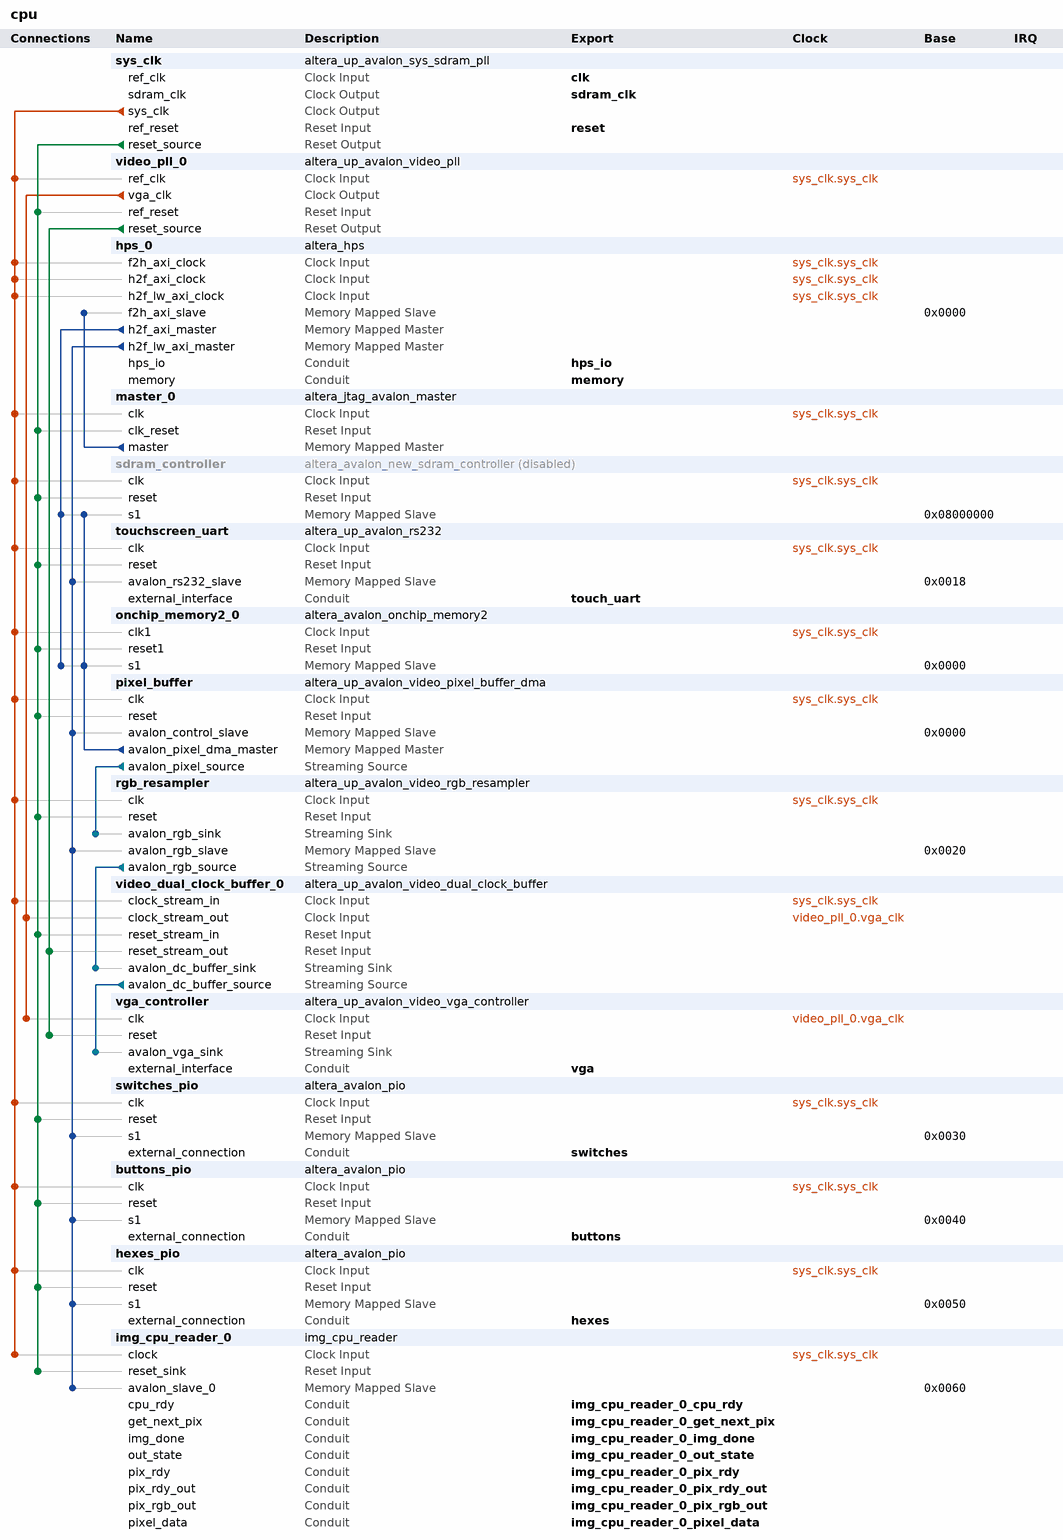
[diagram p0: system contents]
# Platform Designer (Qsys) system cpu, Cyclone V 5CSEMA5F31C6
# Parameters at their usual value, and those the tool derives, are not listed.
package require -exact qsys 18.1
create_system cpu
set_project_property DEVICE_FAMILY {Cyclone V}
set_project_property DEVICE 5CSEMA5F31C6

add_instance sys_clk altera_up_avalon_sys_sdram_pll 18.0
set_instance_parameter_value sys_clk CV_boards DE1-SoC
set_instance_parameter_value sys_clk gui_outclk 50.0
set_instance_parameter_value sys_clk gui_refclk 50.0

add_instance video_pll_0 altera_up_avalon_video_pll 18.0
set_instance_parameter_value video_pll_0 camera {5MP Digital Camera (THDB_D5M)}
set_instance_parameter_value video_pll_0 gui_refclk 50.0
set_instance_parameter_value video_pll_0 lcd {7" LCD on VEEK-MT and MTL/MTL2 Modules}

add_instance hps_0 altera_hps 18.1
set_instance_parameter_value hps_0 EMAC1_Mode RGMII
set_instance_parameter_value hps_0 EMAC1_PinMuxing {HPS I/O Set 0}
set_instance_parameter_value hps_0 F2SCLK_COLDRST_Enable false
set_instance_parameter_value hps_0 F2SCLK_DBGRST_Enable false
set_instance_parameter_value hps_0 F2SCLK_WARMRST_Enable false
set_instance_parameter_value hps_0 F2SINTERRUPT_Enable false
set_instance_parameter_value hps_0 F2S_Width 2
set_instance_parameter_value hps_0 FPGA_PERIPHERAL_OUTPUT_CLOCK_FREQ_EMAC0_GTX_CLK 125
set_instance_parameter_value hps_0 FPGA_PERIPHERAL_OUTPUT_CLOCK_FREQ_EMAC0_MD_CLK 2.5
set_instance_parameter_value hps_0 FPGA_PERIPHERAL_OUTPUT_CLOCK_FREQ_EMAC1_GTX_CLK 125
set_instance_parameter_value hps_0 FPGA_PERIPHERAL_OUTPUT_CLOCK_FREQ_EMAC1_MD_CLK 2.5
set_instance_parameter_value hps_0 HPS_PROTOCOL DDR3
set_instance_parameter_value hps_0 I2C0_Mode I2C
set_instance_parameter_value hps_0 I2C0_PinMuxing {HPS I/O Set 0}
set_instance_parameter_value hps_0 I2C1_Mode I2C
set_instance_parameter_value hps_0 I2C1_PinMuxing {HPS I/O Set 0}
set_instance_parameter_value hps_0 LWH2F_Enable true
set_instance_parameter_value hps_0 MEM_BANKADDR_WIDTH 3
set_instance_parameter_value hps_0 MEM_CLK_FREQ 400.0
set_instance_parameter_value hps_0 MEM_COL_ADDR_WIDTH 10
set_instance_parameter_value hps_0 MEM_DQ_WIDTH 32
set_instance_parameter_value hps_0 MEM_DRV_STR RZQ/7
set_instance_parameter_value hps_0 MEM_ROW_ADDR_WIDTH 15
set_instance_parameter_value hps_0 MEM_RTT_NOM RZQ/4
set_instance_parameter_value hps_0 MEM_RTT_WR RZQ/4
set_instance_parameter_value hps_0 MEM_TCL 11
set_instance_parameter_value hps_0 MEM_TFAW_NS 30.0
set_instance_parameter_value hps_0 MEM_TRAS_NS 35.0
set_instance_parameter_value hps_0 MEM_TRCD_NS 13.75
set_instance_parameter_value hps_0 MEM_TRFC_NS 260.0
set_instance_parameter_value hps_0 MEM_TRP_NS 13.75
set_instance_parameter_value hps_0 MEM_VENDOR JEDEC
set_instance_parameter_value hps_0 MEM_WTCL 8
set_instance_parameter_value hps_0 QSPI_Mode {1 SS}
set_instance_parameter_value hps_0 QSPI_PinMuxing {HPS I/O Set 0}
set_instance_parameter_value hps_0 REF_CLK_FREQ 25.0
set_instance_parameter_value hps_0 S2FCLK_USER2CLK 5
set_instance_parameter_value hps_0 S2F_Width 2
set_instance_parameter_value hps_0 SDIO_Mode {4-bit Data}
set_instance_parameter_value hps_0 SDIO_PinMuxing {HPS I/O Set 0}
set_instance_parameter_value hps_0 SPIM1_Mode {Single Slave Select}
set_instance_parameter_value hps_0 SPIM1_PinMuxing {HPS I/O Set 0}
set_instance_parameter_value hps_0 STM_Enable false
set_instance_parameter_value hps_0 TIMING_BOARD_AC_SKEW 0.02
set_instance_parameter_value hps_0 TIMING_BOARD_AC_TO_CK_SKEW 0.01
set_instance_parameter_value hps_0 TIMING_BOARD_DQ_TO_DQS_SKEW 0.05
set_instance_parameter_value hps_0 TIMING_BOARD_MAX_CK_DELAY 0.03
set_instance_parameter_value hps_0 TIMING_BOARD_MAX_DQS_DELAY 0.02
set_instance_parameter_value hps_0 TIMING_BOARD_SKEW_BETWEEN_DQS 0.06
set_instance_parameter_value hps_0 TIMING_BOARD_SKEW_CKDQS_DIMM_MAX 0.12
set_instance_parameter_value hps_0 TIMING_BOARD_SKEW_CKDQS_DIMM_MIN 0.06
set_instance_parameter_value hps_0 TIMING_BOARD_SKEW_WITHIN_DQS 0.01
set_instance_parameter_value hps_0 TIMING_TDH 65
set_instance_parameter_value hps_0 TIMING_TDQSCK 225
set_instance_parameter_value hps_0 TIMING_TDQSQ 125
set_instance_parameter_value hps_0 TIMING_TDS 30
set_instance_parameter_value hps_0 TIMING_TIH 140
set_instance_parameter_value hps_0 TIMING_TIS 180
set_instance_parameter_value hps_0 TIMING_TQSH 0.4
set_instance_parameter_value hps_0 UART0_Mode {No Flow Control}
set_instance_parameter_value hps_0 UART0_PinMuxing {HPS I/O Set 0}
set_instance_parameter_value hps_0 USB1_Mode SDR
set_instance_parameter_value hps_0 USB1_PinMuxing {HPS I/O Set 0}
set_instance_parameter_value hps_0 desired_cfg_clk_mhz 100.0
set_instance_parameter_value hps_0 desired_qspi_clk_mhz 400.0

add_instance master_0 altera_jtag_avalon_master 18.1

add_instance sdram_controller altera_avalon_new_sdram_controller 18.1
set_instance_property sdram_controller ENABLED false
set_instance_parameter_value sdram_controller TAC 5.4
set_instance_parameter_value sdram_controller TRCD 15.0
set_instance_parameter_value sdram_controller TRP 15.0
set_instance_parameter_value sdram_controller casLatency 3
set_instance_parameter_value sdram_controller columnWidth 10
set_instance_parameter_value sdram_controller dataWidth 16
set_instance_parameter_value sdram_controller generateSimulationModel false
set_instance_parameter_value sdram_controller model single_Micron_MT48LC4M32B2_7_chip
set_instance_parameter_value sdram_controller numberOfBanks 4
set_instance_parameter_value sdram_controller numberOfChipSelects 1
set_instance_parameter_value sdram_controller powerUpDelay 100.0
set_instance_parameter_value sdram_controller refreshPeriod 7.8125
set_instance_parameter_value sdram_controller rowWidth 13

add_instance touchscreen_uart altera_up_avalon_rs232 17.1
set_instance_parameter_value touchscreen_uart baud 9600
set_instance_parameter_value touchscreen_uart parity None

add_instance onchip_memory2_0 altera_avalon_onchip_memory2 18.1
set_instance_parameter_value onchip_memory2_0 dataWidth 32
set_instance_parameter_value onchip_memory2_0 dualPort false
set_instance_parameter_value onchip_memory2_0 initMemContent true
set_instance_parameter_value onchip_memory2_0 initializationFileName onchip_mem.hex
set_instance_parameter_value onchip_memory2_0 memorySize 614400

add_instance pixel_buffer altera_up_avalon_video_pixel_buffer_dma 18.0
set_instance_parameter_value pixel_buffer addr_mode Consecutive
set_instance_parameter_value pixel_buffer back_start_address 0
set_instance_parameter_value pixel_buffer color_space {16-bit RGB}
set_instance_parameter_value pixel_buffer image_height 480
set_instance_parameter_value pixel_buffer image_width 640
set_instance_parameter_value pixel_buffer start_address 0

add_instance rgb_resampler altera_up_avalon_video_rgb_resampler 18.0
set_instance_parameter_value rgb_resampler alpha 1023
set_instance_parameter_value rgb_resampler input_type {16-bit RGB}
set_instance_parameter_value rgb_resampler output_type {30-bit RGB}

add_instance video_dual_clock_buffer_0 altera_up_avalon_video_dual_clock_buffer 18.0
set_instance_parameter_value video_dual_clock_buffer_0 color_bits 10

add_instance vga_controller altera_up_avalon_video_vga_controller 18.0
set_instance_parameter_value vga_controller board DE1-SoC
set_instance_parameter_value vga_controller resolution {VGA 640x480}

add_instance switches_pio altera_avalon_pio 18.1
set_instance_parameter_value switches_pio direction Input
set_instance_parameter_value switches_pio width 10

add_instance buttons_pio altera_avalon_pio 18.1
set_instance_parameter_value buttons_pio direction Input
set_instance_parameter_value buttons_pio width 4

add_instance hexes_pio altera_avalon_pio 18.1
set_instance_parameter_value hexes_pio direction Output
set_instance_parameter_value hexes_pio resetValue 268435455
set_instance_parameter_value hexes_pio width 28

add_instance img_cpu_reader_0 img_cpu_reader 1.0

# connections
add_connection sys_clk.sys_clk buttons_pio.clk clock
add_connection sys_clk.sys_clk hexes_pio.clk clock
add_connection sys_clk.sys_clk hps_0.f2h_axi_clock clock
add_connection sys_clk.sys_clk hps_0.h2f_axi_clock clock
add_connection sys_clk.sys_clk hps_0.h2f_lw_axi_clock clock
add_connection sys_clk.sys_clk img_cpu_reader_0.clock clock
add_connection sys_clk.sys_clk master_0.clk clock
add_connection sys_clk.sys_clk onchip_memory2_0.clk1 clock
add_connection sys_clk.sys_clk pixel_buffer.clk clock
add_connection sys_clk.sys_clk rgb_resampler.clk clock
add_connection sys_clk.sys_clk sdram_controller.clk clock
add_connection sys_clk.sys_clk switches_pio.clk clock
add_connection sys_clk.sys_clk touchscreen_uart.clk clock
add_connection sys_clk.sys_clk video_dual_clock_buffer_0.clock_stream_in clock
add_connection sys_clk.sys_clk video_pll_0.ref_clk clock
add_connection video_pll_0.vga_clk vga_controller.clk clock
add_connection video_pll_0.vga_clk video_dual_clock_buffer_0.clock_stream_out clock
add_connection sys_clk.reset_source buttons_pio.reset reset
add_connection sys_clk.reset_source hexes_pio.reset reset
add_connection sys_clk.reset_source img_cpu_reader_0.reset_sink reset
add_connection sys_clk.reset_source master_0.clk_reset reset
add_connection sys_clk.reset_source onchip_memory2_0.reset1 reset
add_connection sys_clk.reset_source pixel_buffer.reset reset
add_connection sys_clk.reset_source rgb_resampler.reset reset
add_connection sys_clk.reset_source sdram_controller.reset reset
add_connection sys_clk.reset_source switches_pio.reset reset
add_connection sys_clk.reset_source touchscreen_uart.reset reset
add_connection sys_clk.reset_source video_dual_clock_buffer_0.reset_stream_in reset
add_connection sys_clk.reset_source video_pll_0.ref_reset reset
add_connection video_pll_0.reset_source vga_controller.reset reset
add_connection video_pll_0.reset_source video_dual_clock_buffer_0.reset_stream_out reset
add_connection hps_0.h2f_axi_master onchip_memory2_0.s1 avalon
set_connection_parameter_value hps_0.h2f_axi_master/onchip_memory2_0.s1 baseAddress 0x0000
add_connection hps_0.h2f_axi_master sdram_controller.s1 avalon
set_connection_parameter_value hps_0.h2f_axi_master/sdram_controller.s1 baseAddress 0x08000000
add_connection hps_0.h2f_lw_axi_master buttons_pio.s1 avalon
set_connection_parameter_value hps_0.h2f_lw_axi_master/buttons_pio.s1 baseAddress 0x0040
add_connection hps_0.h2f_lw_axi_master hexes_pio.s1 avalon
set_connection_parameter_value hps_0.h2f_lw_axi_master/hexes_pio.s1 baseAddress 0x0050
add_connection hps_0.h2f_lw_axi_master img_cpu_reader_0.avalon_slave_0 avalon
set_connection_parameter_value hps_0.h2f_lw_axi_master/img_cpu_reader_0.avalon_slave_0 baseAddress 0x0060
add_connection hps_0.h2f_lw_axi_master pixel_buffer.avalon_control_slave avalon
set_connection_parameter_value hps_0.h2f_lw_axi_master/pixel_buffer.avalon_control_slave baseAddress 0x0000
add_connection hps_0.h2f_lw_axi_master rgb_resampler.avalon_rgb_slave avalon
set_connection_parameter_value hps_0.h2f_lw_axi_master/rgb_resampler.avalon_rgb_slave baseAddress 0x0020
add_connection hps_0.h2f_lw_axi_master switches_pio.s1 avalon
set_connection_parameter_value hps_0.h2f_lw_axi_master/switches_pio.s1 baseAddress 0x0030
add_connection hps_0.h2f_lw_axi_master touchscreen_uart.avalon_rs232_slave avalon
set_connection_parameter_value hps_0.h2f_lw_axi_master/touchscreen_uart.avalon_rs232_slave baseAddress 0x0018
add_connection master_0.master hps_0.f2h_axi_slave avalon
set_connection_parameter_value master_0.master/hps_0.f2h_axi_slave baseAddress 0x0000
add_connection pixel_buffer.avalon_pixel_dma_master onchip_memory2_0.s1 avalon
set_connection_parameter_value pixel_buffer.avalon_pixel_dma_master/onchip_memory2_0.s1 baseAddress 0x0000
add_connection pixel_buffer.avalon_pixel_dma_master sdram_controller.s1 avalon
set_connection_parameter_value pixel_buffer.avalon_pixel_dma_master/sdram_controller.s1 baseAddress 0x08000000
add_connection pixel_buffer.avalon_pixel_source rgb_resampler.avalon_rgb_sink avalon_streaming
add_connection rgb_resampler.avalon_rgb_source video_dual_clock_buffer_0.avalon_dc_buffer_sink avalon_streaming
add_connection video_dual_clock_buffer_0.avalon_dc_buffer_source vga_controller.avalon_vga_sink avalon_streaming

# exported interfaces
add_interface buttons conduit end
set_interface_property buttons EXPORT_OF buttons_pio.external_connection
add_interface clk clock sink
set_interface_property clk EXPORT_OF sys_clk.ref_clk
add_interface hexes conduit end
set_interface_property hexes EXPORT_OF hexes_pio.external_connection
add_interface hps_io conduit end
set_interface_property hps_io EXPORT_OF hps_0.hps_io
add_interface img_cpu_reader_0_cpu_rdy conduit end
set_interface_property img_cpu_reader_0_cpu_rdy EXPORT_OF img_cpu_reader_0.cpu_rdy
add_interface img_cpu_reader_0_get_next_pix conduit end
set_interface_property img_cpu_reader_0_get_next_pix EXPORT_OF img_cpu_reader_0.get_next_pix
add_interface img_cpu_reader_0_img_done conduit end
set_interface_property img_cpu_reader_0_img_done EXPORT_OF img_cpu_reader_0.img_done
add_interface img_cpu_reader_0_out_state conduit end
set_interface_property img_cpu_reader_0_out_state EXPORT_OF img_cpu_reader_0.out_state
add_interface img_cpu_reader_0_pix_rdy conduit end
set_interface_property img_cpu_reader_0_pix_rdy EXPORT_OF img_cpu_reader_0.pix_rdy
add_interface img_cpu_reader_0_pix_rdy_out conduit end
set_interface_property img_cpu_reader_0_pix_rdy_out EXPORT_OF img_cpu_reader_0.pix_rdy_out
add_interface img_cpu_reader_0_pix_rgb_out conduit end
set_interface_property img_cpu_reader_0_pix_rgb_out EXPORT_OF img_cpu_reader_0.pix_rgb_out
add_interface img_cpu_reader_0_pixel_data conduit end
set_interface_property img_cpu_reader_0_pixel_data EXPORT_OF img_cpu_reader_0.pixel_data
add_interface memory conduit end
set_interface_property memory EXPORT_OF hps_0.memory
add_interface reset reset sink
set_interface_property reset EXPORT_OF sys_clk.ref_reset
add_interface sdram_clk clock source
set_interface_property sdram_clk EXPORT_OF sys_clk.sdram_clk
add_interface switches conduit end
set_interface_property switches EXPORT_OF switches_pio.external_connection
add_interface touch_uart conduit end
set_interface_property touch_uart EXPORT_OF touchscreen_uart.external_interface
add_interface vga conduit end
set_interface_property vga EXPORT_OF vga_controller.external_interface

set_interconnect_requirement {$system} qsys_mm.clockCrossingAdapter HANDSHAKE
set_interconnect_requirement {$system} qsys_mm.enableEccProtection FALSE
set_interconnect_requirement {$system} qsys_mm.insertDefaultSlave FALSE
set_interconnect_requirement {$system} qsys_mm.maxAdditionalLatency 1

save_system cpu.qsys
